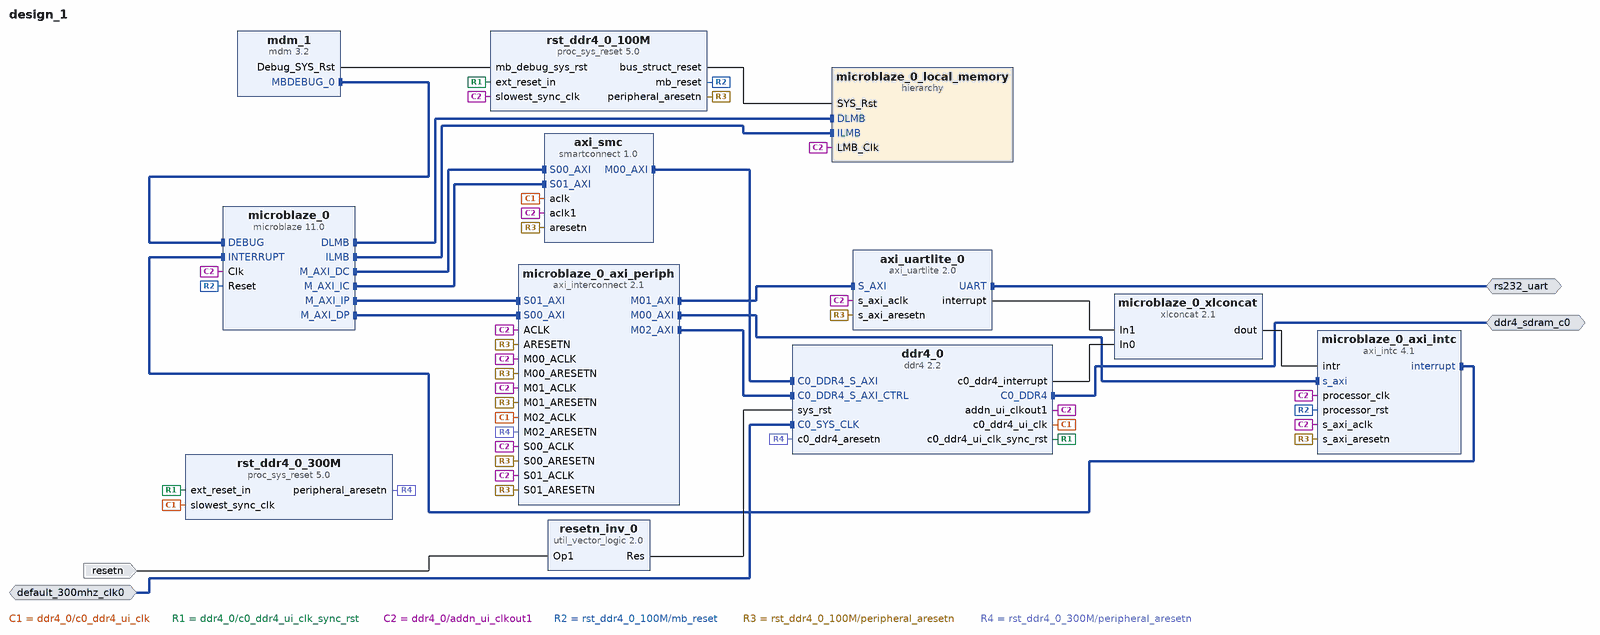
[diagram p0: block diagram of the top level]
# Vivado block design design_1, xcu200-fsgd2104-2-e, Vivado 2023.2.2
create_bd_design design_1

create_bd_intf_port -mode Master -vlnv xilinx.com:interface:ddr4_rtl:1.0 ddr4_sdram_c0
create_bd_intf_port -mode Slave -vlnv xilinx.com:interface:diff_clock_rtl:1.0 default_300mhz_clk0
set_property -dict {CONFIG.FREQ_HZ 300000000} [get_bd_intf_ports default_300mhz_clk0]
create_bd_intf_port -mode Master -vlnv xilinx.com:interface:uart_rtl:1.0 rs232_uart
create_bd_port -dir I -type rst resetn
set_property -dict {CONFIG.POLARITY ACTIVE_LOW} [get_bd_ports resetn]

create_bd_cell -type ip -vlnv xilinx.com:ip:ddr4:2.2 ddr4_0
set_property -dict [list \
  CONFIG.C0_CLOCK_BOARD_INTERFACE default_300mhz_clk0 \
  CONFIG.C0_DDR4_BOARD_INTERFACE ddr4_sdram_c0 \
  CONFIG.RESET_BOARD_INTERFACE resetn \
] [get_bd_cells ddr4_0]
create_bd_cell -type ip -vlnv xilinx.com:ip:microblaze:11.0 microblaze_0
set_property -dict [list \
  CONFIG.C_CACHE_BYTE_SIZE 65536 \
  CONFIG.C_DCACHE_BYTE_SIZE 65536 \
  CONFIG.C_DEBUG_ENABLED 1 \
  CONFIG.C_D_AXI 1 \
  CONFIG.C_D_LMB 1 \
  CONFIG.C_I_AXI 1 \
  CONFIG.C_I_LMB 1 \
  CONFIG.C_USE_DCACHE 1 \
  CONFIG.C_USE_ICACHE 1 \
  CONFIG.G_TEMPLATE_LIST 4 \
] [get_bd_cells microblaze_0]
create_bd_cell -type hier microblaze_0_local_memory
create_bd_cell -type ip -vlnv xilinx.com:ip:axi_interconnect:2.1 microblaze_0_axi_periph
set_property -dict {CONFIG.NUM_MI 3 CONFIG.NUM_SI 2} [get_bd_cells microblaze_0_axi_periph]
create_bd_cell -type ip -vlnv xilinx.com:ip:axi_intc:4.1 microblaze_0_axi_intc
set_property -dict {CONFIG.C_HAS_FAST 1} [get_bd_cells microblaze_0_axi_intc]
create_bd_cell -type ip -vlnv xilinx.com:ip:xlconcat:2.1 microblaze_0_xlconcat
create_bd_cell -type ip -vlnv xilinx.com:ip:mdm:3.2 mdm_1
create_bd_cell -type ip -vlnv xilinx.com:ip:proc_sys_reset:5.0 rst_ddr4_0_100M
set_property -dict {CONFIG.RESET_BOARD_INTERFACE Custom CONFIG.USE_BOARD_FLOW true} [get_bd_cells rst_ddr4_0_100M]
create_bd_cell -type ip -vlnv xilinx.com:ip:axi_uartlite:2.0 axi_uartlite_0
set_property -dict {CONFIG.UARTLITE_BOARD_INTERFACE rs232_uart CONFIG.USE_BOARD_FLOW true} [get_bd_cells axi_uartlite_0]
create_bd_cell -type ip -vlnv xilinx.com:ip:smartconnect:1.0 axi_smc
set_property -dict {CONFIG.NUM_CLKS 2 CONFIG.NUM_SI 2} [get_bd_cells axi_smc]
create_bd_cell -type ip -vlnv xilinx.com:ip:proc_sys_reset:5.0 rst_ddr4_0_300M
create_bd_cell -type ip -vlnv xilinx.com:ip:util_vector_logic:2.0 resetn_inv_0
set_property -dict {CONFIG.C_OPERATION not CONFIG.C_SIZE 1} [get_bd_cells resetn_inv_0]

# ---- hierarchy /microblaze_0_local_memory ----
current_bd_instance /microblaze_0_local_memory
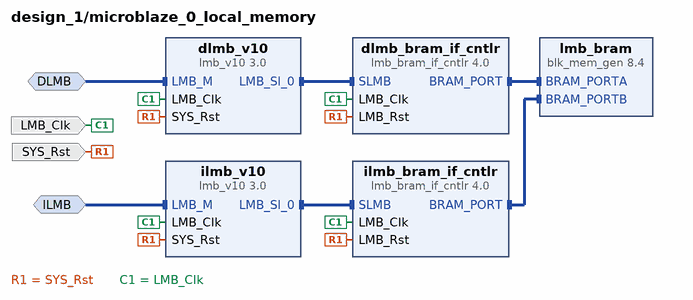
[diagram p1: block diagram inside /microblaze_0_local_memory]
create_bd_intf_pin -mode MirroredMaster -vlnv xilinx.com:interface:lmb_rtl:1.0 DLMB
create_bd_intf_pin -mode MirroredMaster -vlnv xilinx.com:interface:lmb_rtl:1.0 ILMB
create_bd_pin -dir I -type clk LMB_Clk
create_bd_pin -dir I -type rst SYS_Rst

create_bd_cell -type ip -vlnv xilinx.com:ip:lmb_v10:3.0 dlmb_v10
create_bd_cell -type ip -vlnv xilinx.com:ip:lmb_v10:3.0 ilmb_v10
create_bd_cell -type ip -vlnv xilinx.com:ip:lmb_bram_if_cntlr:4.0 dlmb_bram_if_cntlr
set_property -dict {CONFIG.C_ECC 0} [get_bd_cells dlmb_bram_if_cntlr]
create_bd_cell -type ip -vlnv xilinx.com:ip:lmb_bram_if_cntlr:4.0 ilmb_bram_if_cntlr
set_property -dict {CONFIG.C_ECC 0} [get_bd_cells ilmb_bram_if_cntlr]
create_bd_cell -type ip -vlnv xilinx.com:ip:blk_mem_gen:8.4 lmb_bram
set_property -dict {CONFIG.Memory_Type True_Dual_Port_RAM CONFIG.use_bram_block BRAM_Controller} [get_bd_cells lmb_bram]

# ---- connections ----

current_bd_instance /microblaze_0_local_memory
connect_bd_intf_net -intf_net microblaze_0_dlmb [get_bd_intf_pins dlmb_v10/LMB_M] [get_bd_intf_pins DLMB]
connect_bd_intf_net -intf_net microblaze_0_dlmb_bus [get_bd_intf_pins dlmb_v10/LMB_Sl_0] [get_bd_intf_pins dlmb_bram_if_cntlr/SLMB]
connect_bd_intf_net -intf_net microblaze_0_dlmb_cntlr [get_bd_intf_pins dlmb_bram_if_cntlr/BRAM_PORT] [get_bd_intf_pins lmb_bram/BRAM_PORTA]
connect_bd_intf_net -intf_net microblaze_0_ilmb [get_bd_intf_pins ilmb_v10/LMB_M] [get_bd_intf_pins ILMB]
connect_bd_intf_net -intf_net microblaze_0_ilmb_bus [get_bd_intf_pins ilmb_v10/LMB_Sl_0] [get_bd_intf_pins ilmb_bram_if_cntlr/SLMB]
connect_bd_intf_net -intf_net microblaze_0_ilmb_cntlr [get_bd_intf_pins ilmb_bram_if_cntlr/BRAM_PORT] [get_bd_intf_pins lmb_bram/BRAM_PORTB]
connect_bd_net [get_bd_pins SYS_Rst] \
  [get_bd_pins dlmb_v10/SYS_Rst] [get_bd_pins dlmb_bram_if_cntlr/LMB_Rst] [get_bd_pins ilmb_v10/SYS_Rst] \
  [get_bd_pins ilmb_bram_if_cntlr/LMB_Rst]
connect_bd_net -net microblaze_0_Clk [get_bd_pins LMB_Clk] \
  [get_bd_pins dlmb_v10/LMB_Clk] [get_bd_pins dlmb_bram_if_cntlr/LMB_Clk] [get_bd_pins ilmb_v10/LMB_Clk] \
  [get_bd_pins ilmb_bram_if_cntlr/LMB_Clk]
set_property HDL_ATTRIBUTE.BMM_INFO_ADDRESS_SPACE {byte  0x00000000 32 > design_1 microblaze_0_local_memory/lmb_bram} [get_bd_cells dlmb_bram_if_cntlr]
set_property HDL_ATTRIBUTE.KEEP_HIERARCHY yes [get_bd_cells dlmb_bram_if_cntlr]

current_bd_instance /
connect_bd_intf_net [get_bd_intf_pins axi_smc/M00_AXI] [get_bd_intf_pins ddr4_0/C0_DDR4_S_AXI]
connect_bd_intf_net [get_bd_intf_ports rs232_uart] [get_bd_intf_pins axi_uartlite_0/UART]
connect_bd_intf_net [get_bd_intf_ports ddr4_sdram_c0] [get_bd_intf_pins ddr4_0/C0_DDR4]
connect_bd_intf_net -intf_net default_300mhz_clk0_1 [get_bd_intf_ports default_300mhz_clk0] [get_bd_intf_pins ddr4_0/C0_SYS_CLK]
connect_bd_intf_net [get_bd_intf_pins microblaze_0/M_AXI_DC] [get_bd_intf_pins axi_smc/S00_AXI]
connect_bd_intf_net [get_bd_intf_pins microblaze_0/M_AXI_IC] [get_bd_intf_pins axi_smc/S01_AXI]
connect_bd_intf_net [get_bd_intf_pins microblaze_0/M_AXI_IP] [get_bd_intf_pins microblaze_0_axi_periph/S01_AXI]
connect_bd_intf_net -intf_net microblaze_0_axi_dp [get_bd_intf_pins microblaze_0_axi_periph/S00_AXI] [get_bd_intf_pins microblaze_0/M_AXI_DP]
connect_bd_intf_net [get_bd_intf_pins microblaze_0_axi_periph/M01_AXI] [get_bd_intf_pins axi_uartlite_0/S_AXI]
connect_bd_intf_net [get_bd_intf_pins microblaze_0_axi_periph/M02_AXI] [get_bd_intf_pins ddr4_0/C0_DDR4_S_AXI_CTRL]
connect_bd_intf_net [get_bd_intf_pins mdm_1/MBDEBUG_0] [get_bd_intf_pins microblaze_0/DEBUG]
connect_bd_intf_net [get_bd_intf_pins microblaze_0/DLMB] [get_bd_intf_pins microblaze_0_local_memory/DLMB]
connect_bd_intf_net [get_bd_intf_pins microblaze_0/ILMB] [get_bd_intf_pins microblaze_0_local_memory/ILMB]
connect_bd_intf_net -intf_net microblaze_0_intc_axi [get_bd_intf_pins microblaze_0_axi_periph/M00_AXI] [get_bd_intf_pins microblaze_0_axi_intc/s_axi]
connect_bd_intf_net [get_bd_intf_pins microblaze_0_axi_intc/interrupt] [get_bd_intf_pins microblaze_0/INTERRUPT]
connect_bd_net [get_bd_pins axi_uartlite_0/interrupt] [get_bd_pins microblaze_0_xlconcat/In1]
connect_bd_net [get_bd_pins ddr4_0/c0_ddr4_interrupt] [get_bd_pins microblaze_0_xlconcat/In0]
connect_bd_net [get_bd_pins ddr4_0/c0_ddr4_ui_clk] \
  [get_bd_pins axi_smc/aclk] [get_bd_pins rst_ddr4_0_300M/slowest_sync_clk] [get_bd_pins microblaze_0_axi_periph/M02_ACLK]
connect_bd_net [get_bd_pins ddr4_0/c0_ddr4_ui_clk_sync_rst] [get_bd_pins rst_ddr4_0_300M/ext_reset_in] [get_bd_pins rst_ddr4_0_100M/ext_reset_in]
connect_bd_net [get_bd_pins mdm_1/Debug_SYS_Rst] [get_bd_pins rst_ddr4_0_100M/mb_debug_sys_rst]
connect_bd_net -net microblaze_0_Clk [get_bd_pins ddr4_0/addn_ui_clkout1] \
  [get_bd_pins microblaze_0/Clk] [get_bd_pins microblaze_0_axi_periph/ACLK] [get_bd_pins microblaze_0_axi_periph/S00_ACLK] \
  [get_bd_pins microblaze_0_axi_periph/M00_ACLK] [get_bd_pins microblaze_0_axi_intc/s_axi_aclk] \
  [get_bd_pins microblaze_0_axi_intc/processor_clk] [get_bd_pins microblaze_0_local_memory/LMB_Clk] \
  [get_bd_pins rst_ddr4_0_100M/slowest_sync_clk] [get_bd_pins axi_uartlite_0/s_axi_aclk] \
  [get_bd_pins microblaze_0_axi_periph/M01_ACLK] [get_bd_pins axi_smc/aclk1] [get_bd_pins microblaze_0_axi_periph/S01_ACLK]
connect_bd_net -net microblaze_0_intr [get_bd_pins microblaze_0_xlconcat/dout] [get_bd_pins microblaze_0_axi_intc/intr]
connect_bd_net [get_bd_ports resetn] [get_bd_pins resetn_inv_0/Op1]
connect_bd_net [get_bd_pins resetn_inv_0/Res] [get_bd_pins ddr4_0/sys_rst]
connect_bd_net [get_bd_pins rst_ddr4_0_100M/bus_struct_reset] [get_bd_pins microblaze_0_local_memory/SYS_Rst]
connect_bd_net [get_bd_pins rst_ddr4_0_100M/mb_reset] [get_bd_pins microblaze_0/Reset] [get_bd_pins microblaze_0_axi_intc/processor_rst]
connect_bd_net [get_bd_pins rst_ddr4_0_100M/peripheral_aresetn] \
  [get_bd_pins microblaze_0_axi_periph/ARESETN] [get_bd_pins microblaze_0_axi_periph/S00_ARESETN] \
  [get_bd_pins microblaze_0_axi_periph/M00_ARESETN] [get_bd_pins microblaze_0_axi_intc/s_axi_aresetn] \
  [get_bd_pins axi_uartlite_0/s_axi_aresetn] [get_bd_pins microblaze_0_axi_periph/M01_ARESETN] [get_bd_pins axi_smc/aresetn] \
  [get_bd_pins microblaze_0_axi_periph/S01_ARESETN]
connect_bd_net [get_bd_pins rst_ddr4_0_300M/peripheral_aresetn] [get_bd_pins ddr4_0/c0_ddr4_aresetn] [get_bd_pins microblaze_0_axi_periph/M02_ARESETN]
set_property HDL_ATTRIBUTE.BMM_INFO_PROCESSOR {microblaze-le > design_1 microblaze_0_local_memory/dlmb_bram_if_cntlr} [get_bd_cells microblaze_0]
set_property HDL_ATTRIBUTE.KEEP_HIERARCHY yes [get_bd_cells microblaze_0]

# ---- address map ----
assign_bd_address -offset 0x00000000 -range 64K -target_address_space [get_bd_addr_spaces microblaze_0/Data] [get_bd_addr_segs microblaze_0_local_memory/dlmb_bram_if_cntlr/SLMB/Mem]
assign_bd_address -offset 0x40600000 -range 64K -target_address_space [get_bd_addr_spaces microblaze_0/Data] [get_bd_addr_segs axi_uartlite_0/S_AXI/Reg]
assign_bd_address -offset 0x41200000 -range 64K -target_address_space [get_bd_addr_spaces microblaze_0/Data] [get_bd_addr_segs microblaze_0_axi_intc/S_AXI/Reg]
assign_bd_address -offset 0x41300000 -range 1M -target_address_space [get_bd_addr_spaces microblaze_0/Data] [get_bd_addr_segs ddr4_0/C0_DDR4_MEMORY_MAP_CTRL/C0_REG]
assign_bd_address -offset 0x80000000 -range 2G -target_address_space [get_bd_addr_spaces microblaze_0/Data] [get_bd_addr_segs ddr4_0/C0_DDR4_MEMORY_MAP/C0_DDR4_ADDRESS_BLOCK]
assign_bd_address -offset 0x00000000 -range 64K -target_address_space [get_bd_addr_spaces microblaze_0/Instruction] [get_bd_addr_segs microblaze_0_local_memory/ilmb_bram_if_cntlr/SLMB/Mem]
assign_bd_address -offset 0x40600000 -range 64K -target_address_space [get_bd_addr_spaces microblaze_0/Instruction] [get_bd_addr_segs axi_uartlite_0/S_AXI/Reg]
assign_bd_address -offset 0x41200000 -range 64K -target_address_space [get_bd_addr_spaces microblaze_0/Instruction] [get_bd_addr_segs microblaze_0_axi_intc/S_AXI/Reg]
assign_bd_address -offset 0x41300000 -range 1M -target_address_space [get_bd_addr_spaces microblaze_0/Instruction] [get_bd_addr_segs ddr4_0/C0_DDR4_MEMORY_MAP_CTRL/C0_REG]
assign_bd_address -offset 0x80000000 -range 2G -target_address_space [get_bd_addr_spaces microblaze_0/Instruction] [get_bd_addr_segs ddr4_0/C0_DDR4_MEMORY_MAP/C0_DDR4_ADDRESS_BLOCK]

validate_bd_design
save_bd_design
